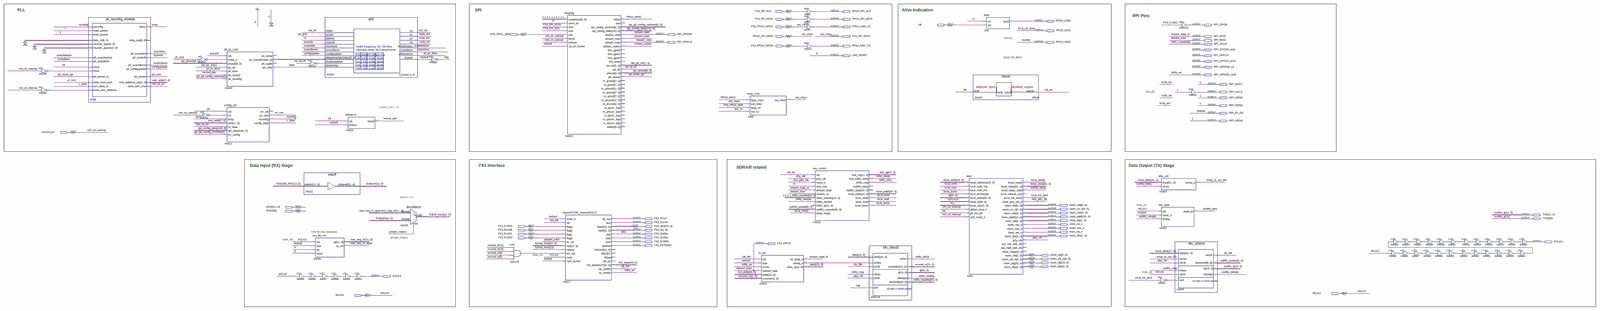
[diagram p0: schematic sheet, whole]
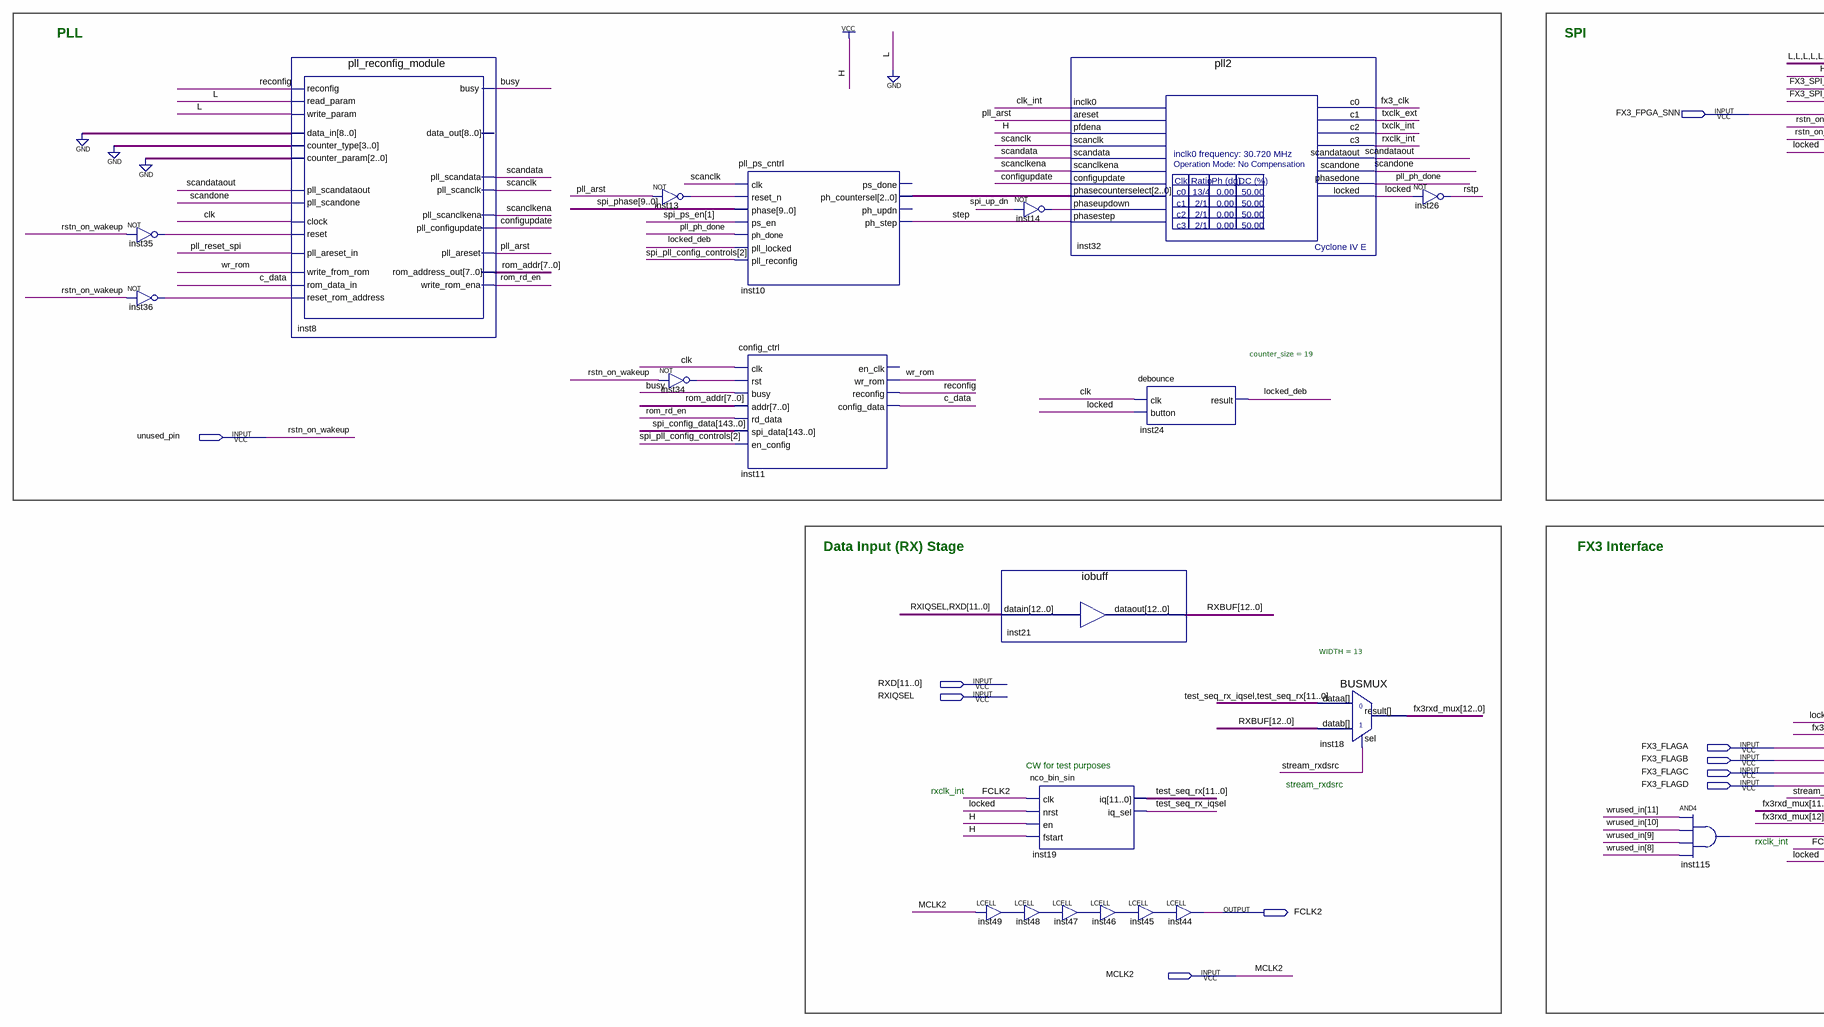
[diagram p1: schematic sheet, left part]
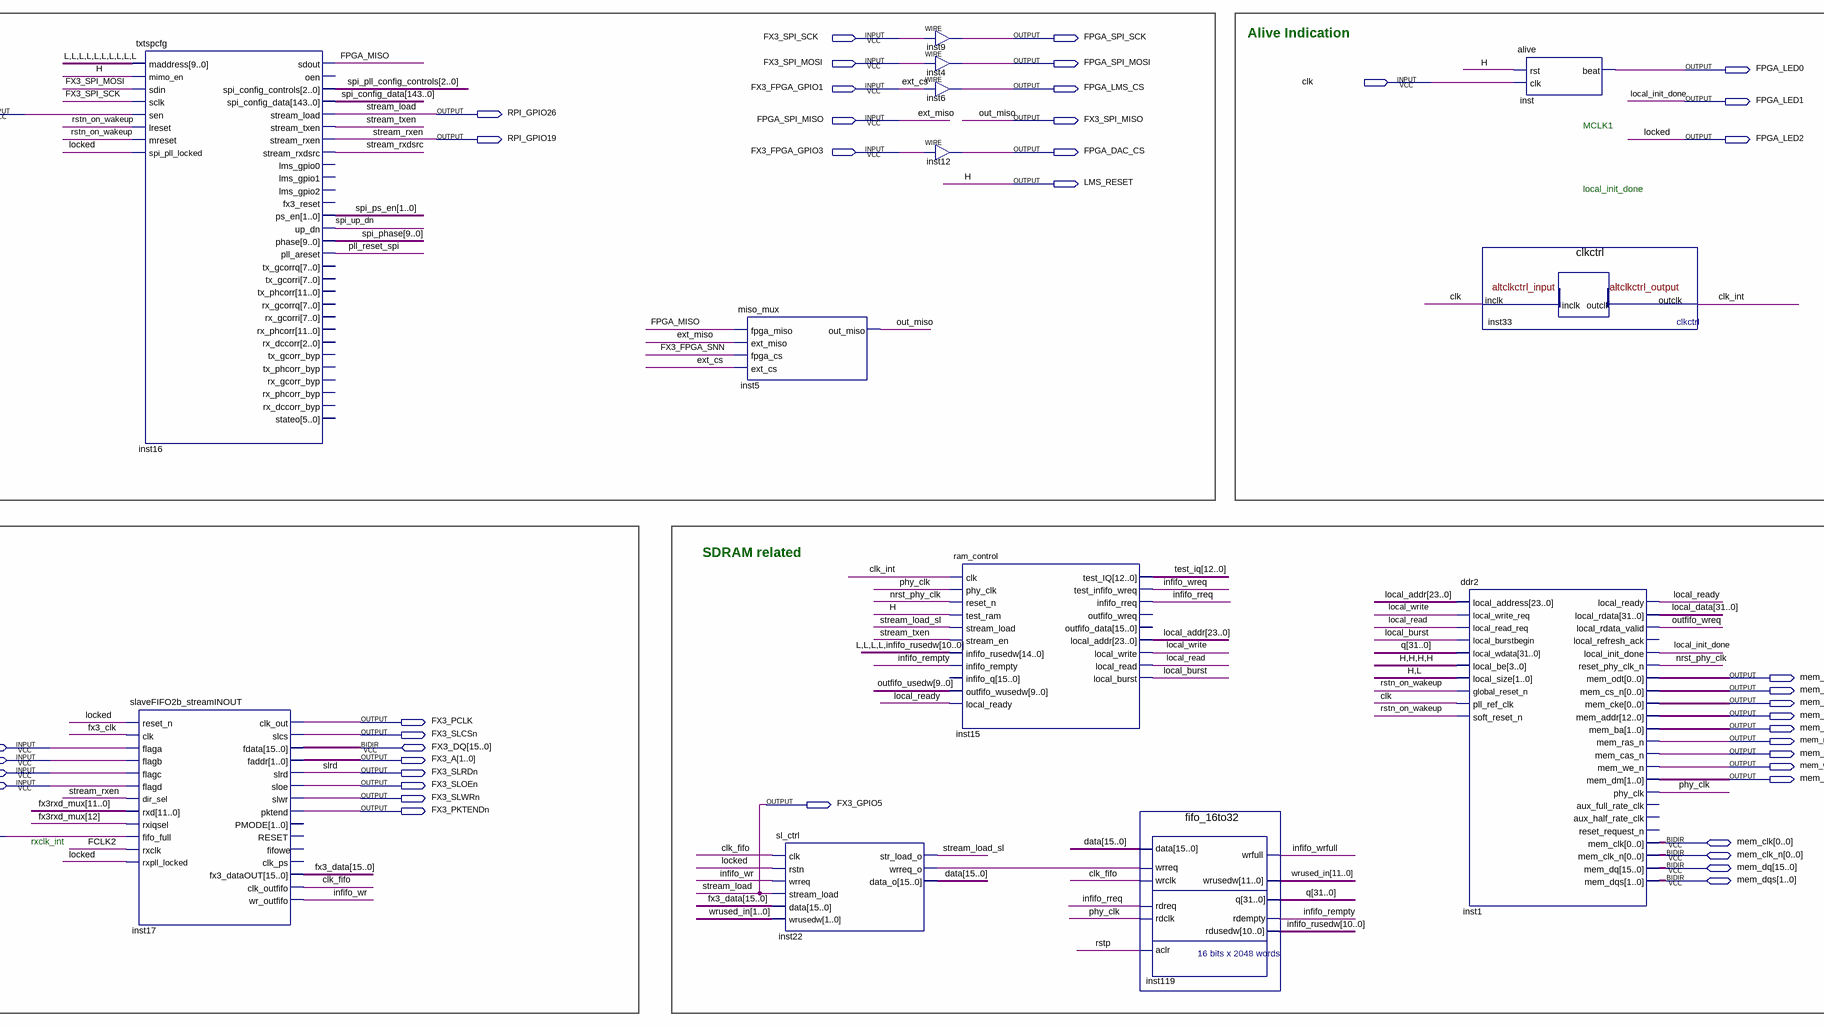
[diagram p2: schematic sheet, centre part]
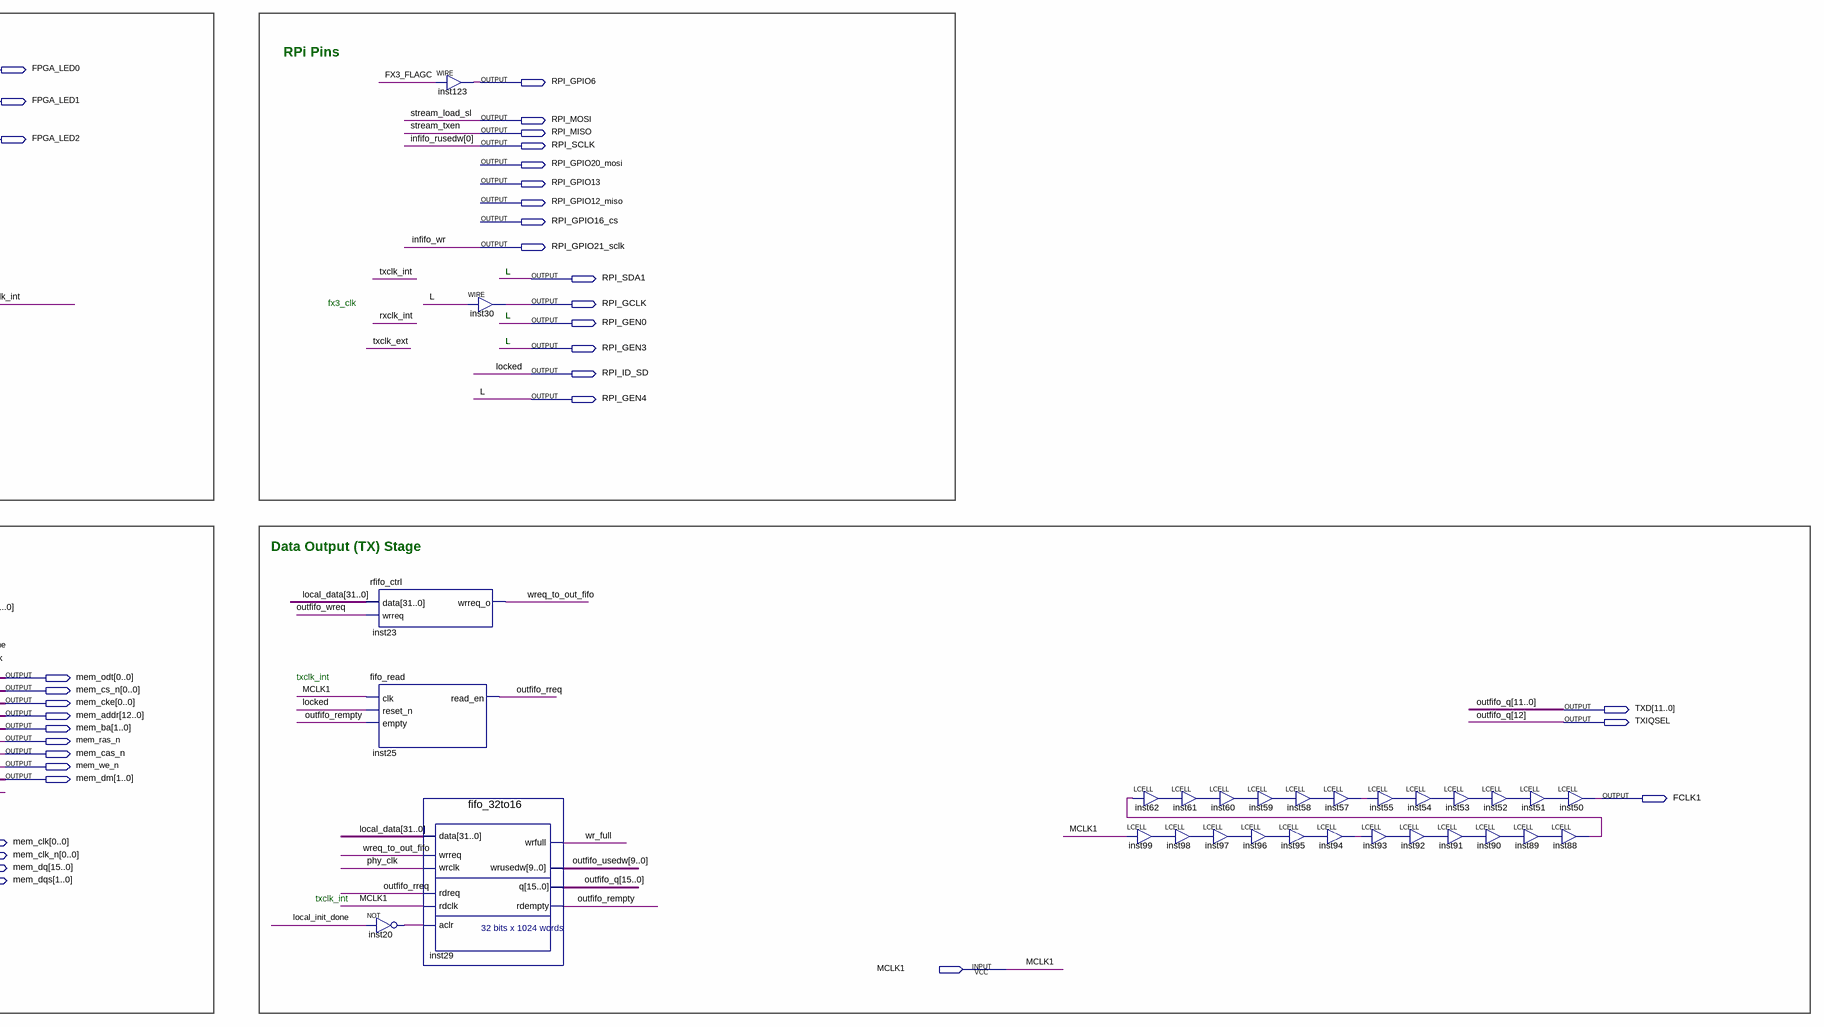
[diagram p3: schematic sheet, right part]
// Quartus schematic lms7_uStream_trx_top.bdf as structural Verilog: 64 symbols, 68 pins
module lms7_uStream_trx_top (
  input  FX3_SPI_SCK,
  input  FX3_SPI_MOSI,
  input  clk,
  input  FX3_FPGA_GPIO1,
  input  FX3_FPGA_SNN,
  input  FPGA_SPI_MISO,
  input  FX3_FPGA_GPIO3,
  input  unused_pin,
  input  [11:0] RXD,
  input  RXIQSEL,
  input  FX3_FLAGA,
  input  FX3_FLAGB,
  input  FX3_FLAGC,
  input  FX3_FLAGD,
  input  MCLK1,
  input  MCLK2,
  inout  [15:0] FX3_DQ,
  inout  [0:0] mem_clk,
  inout  [0:0] mem_clk_n,
  inout  [15:0] mem_dq,
  inout  [1:0] mem_dqs,
  output FPGA_SPI_SCK,
  output FPGA_SPI_MOSI,
  output FPGA_LED0,
  output RPI_GPIO6,
  output FPGA_LMS_CS,
  output FPGA_LED1,
  output RPI_GPIO26,
  output FX3_SPI_MISO,
  output RPI_MOSI,
  output RPI_MISO,
  output RPI_GPIO19,
  output FPGA_LED2,
  output RPI_SCLK,
  output FPGA_DAC_CS,
  output RPI_GPIO20_mosi,
  output LMS_RESET,
  output RPI_GPIO13,
  output RPI_GPIO12_miso,
  output RPI_GPIO16_cs,
  output RPI_GPIO21_sclk,
  output RPI_SDA1,
  output RPI_GCLK,
  output RPI_GEN0,
  output RPI_GEN3,
  output RPI_ID_SD,
  output RPI_GEN4,
  output [0:0] mem_odt,
  output [0:0] mem_cs_n,
  output [0:0] mem_cke,
  output [11:0] TXD,
  output [12:0] mem_addr,
  output FX3_PCLK,
  output TXIQSEL,
  output [1:0] mem_ba,
  output FX3_SLCSn,
  output mem_ras_n,
  output mem_cas_n,
  output [1:0] FX3_A,
  output mem_we_n,
  output FX3_SLRDn,
  output [1:0] mem_dm,
  output FX3_SLOEn,
  output FX3_SLWRn,
  output FCLK1,
  output FX3_GPIO5,
  output FX3_PKTENDn,
  output FCLK2
);

  wire busy, c_data, clk_fifo, clk_int, configupdate, FPGA_MISO, fx3_clk, infifo_rempty, infifo_rreq,
       infifo_wreq, infifo_wrfull, inst13_out, inst14_out, inst20_out, inst22_wrreq_o, inst34_out,
       inst35_out, inst36_out, inst45_out, inst46_out, inst47_out, inst48_out, inst49_out, inst51_out,
       inst52_out, inst53_out, inst54_out, inst55_out, inst57_out, inst58_out, inst59_out, inst60_out,
       inst61_out, inst62_out, inst88_out, inst89_out, inst90_out, inst91_out, inst92_out, inst93_out,
       inst94_out, inst95_out, inst96_out, inst97_out, inst98_out, inst99_out, inst115_out, local_burst,
       local_read, local_ready, local_write, locked_deb, nrst_phy_clk, outfifo_rempty, outfifo_rreq,
       outfifo_wreq, phy_clk, pll_arst, pll_ph_done, pll_reset_spi, reconfig, rom_rd_en, rstp, rxclk_int,
       scanclk, scanclkena, scandata, scandataout, scandone, spi_up_dn, step, stream_rxdsrc,
       test_seq_rx_iqsel, txclk_ext, txclk_int, wr_full, wr_rom, wreq_to_out_fifo;
  wire [1:0] spi_ps_en;
  wire [2:0] inst10_ph_countersel, spi_pll_config_controls;
  wire [7:0] rom_addr;
  wire [9:0] outfifo_usedw, spi_phase;
  wire [10:1] infifo_rusedw;
  wire [11:0] test_seq_rx, wrused_in;
  wire [12:0] fx3rxd_mux, RXBUF, test_iq;
  wire [15:0] data, fx3_data;
  wire [15:13] outfifo_q;
  wire [23:0] local_addr;
  wire [31:0] local_data, q;
  wire [143:0] spi_config_data;

  not inst35 (inst35_out, unused_pin);
  not inst36 (inst36_out, unused_pin);
  pll_reconfig_module inst8 (
    .reconfig(reconfig), .read_param(1'b0), .write_param(1'b0), .data_in({9{1'b0}}), .counter_type(4'b0000),
    .counter_param(3'b000), .pll_scandataout(scandataout), .pll_scandone(scandone), .clock(clk),
    .reset(inst35_out), .pll_areset_in(pll_reset_spi), .write_from_rom(wr_rom), .rom_data_in(c_data),
    .reset_rom_address(inst36_out), .busy(busy), .pll_scandata(scandata), .pll_scanclk(scanclk),
    .pll_scanclkena(scanclkena), .pll_configupdate(configupdate), .pll_areset(pll_arst),
    .rom_address_out(rom_addr), .write_rom_ena(rom_rd_en));  // open: data_out
  not inst13 (inst13_out, pll_arst);
  not inst34 (inst34_out, unused_pin);
  pll_ps_cntrl inst10 (
    .clk(scanclk), .reset_n(inst13_out), .phase(spi_phase), .ps_en(spi_ps_en[1]), .ph_done(pll_ph_done),
    .pll_locked(locked_deb), .pll_reconfig(spi_pll_config_controls[2]), .ph_countersel(inst10_ph_countersel),
    .ph_step(step));  // open: ps_done, ph_updn
  config_ctrl inst11 (
    .clk(clk), .rst(inst34_out), .busy(busy), .addr(rom_addr), .rd_data(rom_rd_en),
    .spi_data(spi_config_data), .en_config(spi_pll_config_controls[2]), .wr_rom(wr_rom), .reconfig(reconfig),
    .config_data(c_data));  // open: en_clk
  iobuff inst21 (.datain({RXIQSEL, RXD}), .dataout(RXBUF));
  LCELL inst49 (.IN(MCLK2), .OUT(inst49_out));
  not inst14 (inst14_out, spi_up_dn);
  nco_bin_sin inst19 (
    .clk(FCLK2), .nrst(FPGA_LED2), .en(1'b1), .fstart(1'b1), .iq(test_seq_rx), .iq_sel(test_seq_rx_iqsel));
  LCELL inst47 (.IN(inst48_out), .OUT(inst47_out));
  LCELL inst48 (.IN(inst49_out), .OUT(inst48_out));
  pll2 inst32 (
    .inclk0(clk_int), .areset(pll_arst), .pfdena(1'b1), .scanclk(scanclk), .scandata(scandata),
    .scanclkena(scanclkena), .configupdate(configupdate), .phasecounterselect(inst10_ph_countersel),
    .phaseupdown(inst14_out), .phasestep(step), .c0(fx3_clk), .c1(txclk_ext), .c2(txclk_int), .c3(rxclk_int),
    .scandataout(scandataout), .scandone(scandone), .phasedone(pll_ph_done), .locked(FPGA_LED2));
  LCELL inst46 (.IN(inst47_out), .OUT(inst46_out));
  debounce #(.counter_size(19)) inst24 (.clk(clk), .button(FPGA_LED2), .result(locked_deb));
  LCELL inst45 (.IN(inst46_out), .OUT(inst45_out));
  LCELL inst44 (.IN(inst45_out), .OUT(FCLK2));
  BUSMUX #(.WIDTH(13)) inst18 (
    .datab(RXBUF), .sel(stream_rxdsrc), .dataa({test_seq_rx_iqsel, test_seq_rx}), .result(fx3rxd_mux));
  not inst26 (rstp, FPGA_LED2);
  and inst115 (inst115_out, wrused_in[11], wrused_in[10], wrused_in[9], wrused_in[8]);
  txtspcfg inst16 (
    .maddress({10{1'b0}}), .mimo_en(1'b1), .sdin(FX3_SPI_MOSI), .sclk(FX3_SPI_SCK), .sen(FX3_FPGA_SNN),
    .lreset(unused_pin), .mreset(unused_pin), .spi_pll_locked(FPGA_LED2), .sdout(FPGA_MISO),
    .spi_config_controls(spi_pll_config_controls), .spi_config_data(spi_config_data),
    .stream_load(FX3_GPIO5), .stream_txen(RPI_MISO), .stream_rxen(RPI_GPIO19), .stream_rxdsrc(stream_rxdsrc),
    .ps_en(spi_ps_en), .up_dn(spi_up_dn), .phase(spi_phase), .pll_areset(pll_reset_spi));  // open: oen, lms_gpio0, lms_gpio1, lms_gpio2, fx3_reset, tx_gcorrq, tx_gcorri, tx_phcorr, rx_gcorrq, rx_gcorri, rx_phcorr, rx_dccorr, tx_gcorr_byp, tx_phcorr_byp, rx_gcorr_byp, rx_phcorr_byp, rx_dccorr_byp, stateo
  slaveFIFO2b_streamINOUT inst17 (
    .reset_n(FPGA_LED2), .clk(fx3_clk), .flaga(FX3_FLAGA), .flagb(FX3_FLAGB), .flagc(FX3_FLAGC),
    .flagd(FX3_FLAGD), .dir_sel(RPI_GPIO19), .rxd(fx3rxd_mux[11:0]), .rxiqsel(fx3rxd_mux[12]),
    .fifo_full(inst115_out), .rxclk(FCLK2), .rxpll_locked(FPGA_LED2), .clk_out(FX3_PCLK), .slcs(FX3_SLCSn),
    .faddr(FX3_A), .slrd(FX3_SLRDn), .sloe(FX3_SLOEn), .slwr(FX3_SLWRn), .pktend(FX3_PKTENDn),
    .fx3_dataOUT(fx3_data), .clk_outfifo(clk_fifo), .wr_outfifo(RPI_GPIO21_sclk), .fdata(FX3_DQ));  // open: PMODE, RESET, fifowe, clk_ps
  miso_mux inst5 (
    .fpga_miso(FPGA_MISO), .ext_miso(FPGA_SPI_MISO), .fpga_cs(FX3_FPGA_SNN), .ext_cs(FX3_FPGA_GPIO1),
    .out_miso(FX3_SPI_MISO));
  sl_ctrl inst22 (
    .clk(clk_fifo), .rstn(FPGA_LED2), .wrreq(RPI_GPIO21_sclk), .stream_load(FX3_GPIO5), .data(fx3_data),
    .wrusedw(wrused_in[1:0]), .str_load_o(RPI_MOSI), .wrreq_o(inst22_wrreq_o), .data_o(data));
  assign FPGA_SPI_SCK = FX3_SPI_SCK;  // WIRE inst9
  assign FPGA_SPI_MOSI = FX3_SPI_MOSI;  // WIRE inst4
  assign FPGA_LMS_CS = FX3_FPGA_GPIO1;  // WIRE inst6
  assign FPGA_DAC_CS = FX3_FPGA_GPIO3;  // WIRE inst12
  ram_control inst15 (
    .clk(clk_int), .phy_clk(phy_clk), .reset_n(nrst_phy_clk), .test_ram(1'b1), .stream_load(RPI_MOSI),
    .stream_en(RPI_MISO), .infifo_rusedw({4'b0000, infifo_rusedw, RPI_SCLK}), .infifo_rempty(infifo_rempty),
    .outfifo_wusedw(outfifo_usedw), .local_ready(local_ready), .test_IQ(test_iq),
    .test_infifo_wreq(infifo_wreq), .infifo_rreq(infifo_rreq), .local_addr(local_addr),
    .local_write(local_write), .local_read(local_read), .local_burst(local_burst));  // open: infifo_q, outfifo_wreq, outfifo_data
  fifo_16to32 inst119 (
    .data(data), .wrreq(inst22_wrreq_o), .wrclk(clk_fifo), .rdreq(infifo_rreq), .rdclk(phy_clk), .aclr(rstp),
    .wrfull(infifo_wrfull), .wrusedw(wrused_in), .q(q), .rdempty(infifo_rempty),
    .rdusedw({infifo_rusedw, RPI_SCLK}));
  ddr2 inst1 (
    .local_address(local_addr), .local_write_req(local_write), .local_read_req(local_read),
    .local_burstbegin(local_burst), .local_wdata(q), .local_be(4'b1111), .local_size(2'b10),
    .global_reset_n(unused_pin), .pll_ref_clk(clk), .soft_reset_n(unused_pin), .local_ready(local_ready),
    .local_rdata(local_data), .local_rdata_valid(outfifo_wreq), .local_init_done(FPGA_LED1),
    .reset_phy_clk_n(nrst_phy_clk), .mem_odt(mem_odt[0]), .mem_cs_n(mem_cs_n[0]), .mem_cke(mem_cke[0]),
    .mem_addr(mem_addr), .mem_ba(mem_ba), .mem_ras_n(mem_ras_n), .mem_cas_n(mem_cas_n), .mem_we_n(mem_we_n),
    .mem_dm(mem_dm), .phy_clk(phy_clk), .mem_clk(mem_clk[0]), .mem_clk_n(mem_clk_n[0]), .mem_dq(mem_dq),
    .mem_dqs(mem_dqs));  // open: local_refresh_ack, aux_full_rate_clk, aux_half_rate_clk, reset_request_n
  alive inst (.rst(1'b1), .clk(clk), .beat(FPGA_LED0));
  clkctrl inst33 (.inclk(clk), .outclk(clk_int));
  rfifo_ctrl inst23 (.data(local_data), .wrreq(outfifo_wreq), .wrreq_o(wreq_to_out_fifo));
  fifo_read inst25 (.clk(MCLK1), .reset_n(FPGA_LED2), .empty(outfifo_rempty), .read_en(outfifo_rreq));
  not inst20 (inst20_out, FPGA_LED1);
  assign RPI_GPIO6 = FX3_FLAGC;  // WIRE inst123
  fifo_32to16 inst29 (
    .data(local_data), .wrreq(wreq_to_out_fifo), .wrclk(phy_clk), .rdreq(outfifo_rreq), .rdclk(MCLK1),
    .aclr(inst20_out), .wrfull(wr_full), .wrusedw(outfifo_usedw), .q({outfifo_q, TXIQSEL, TXD}),
    .rdempty(outfifo_rempty));
  assign RPI_GCLK = 1'b0;  // WIRE inst30
  LCELL inst62 (.IN(inst88_out), .OUT(inst62_out));
  LCELL inst99 (.IN(MCLK1), .OUT(inst99_out));
  LCELL inst60 (.IN(inst61_out), .OUT(inst60_out));
  LCELL inst61 (.IN(inst62_out), .OUT(inst61_out));
  LCELL inst97 (.IN(inst98_out), .OUT(inst97_out));
  LCELL inst98 (.IN(inst99_out), .OUT(inst98_out));
  LCELL inst59 (.IN(inst60_out), .OUT(inst59_out));
  LCELL inst96 (.IN(inst97_out), .OUT(inst96_out));
  LCELL inst58 (.IN(inst59_out), .OUT(inst58_out));
  LCELL inst95 (.IN(inst96_out), .OUT(inst95_out));
  LCELL inst57 (.IN(inst58_out), .OUT(inst57_out));
  LCELL inst93 (.IN(inst94_out), .OUT(inst93_out));
  LCELL inst94 (.IN(inst95_out), .OUT(inst94_out));
  LCELL inst54 (.IN(inst55_out), .OUT(inst54_out));
  LCELL inst55 (.IN(inst57_out), .OUT(inst55_out));
  LCELL inst92 (.IN(inst93_out), .OUT(inst92_out));
  LCELL inst53 (.IN(inst54_out), .OUT(inst53_out));
  LCELL inst91 (.IN(inst92_out), .OUT(inst91_out));
  LCELL inst52 (.IN(inst53_out), .OUT(inst52_out));
  LCELL inst89 (.IN(inst90_out), .OUT(inst89_out));
  LCELL inst90 (.IN(inst91_out), .OUT(inst90_out));
  LCELL inst50 (.IN(inst51_out), .OUT(FCLK1));
  LCELL inst51 (.IN(inst52_out), .OUT(inst51_out));
  LCELL inst88 (.IN(inst89_out), .OUT(inst88_out));

  assign LMS_RESET = 1'b1;
  assign RPI_GEN0 = 1'b0;
  assign RPI_GEN3 = 1'b0;
  assign RPI_GEN4 = 1'b0;
  assign RPI_GPIO26 = FX3_GPIO5;
  assign RPI_ID_SD = FPGA_LED2;
  assign RPI_SDA1 = 1'b0;

  // Other names for the same wires on the sheet: ext_cs = FX3_FPGA_GPIO1; ext_miso = FPGA_SPI_MISO;
  //   infifo_rusedw[0] = RPI_SCLK; infifo_wr = RPI_GPIO21_sclk; local_init_done = FPGA_LED1; locked = FPGA_LED2;
  //   out_miso = FX3_SPI_MISO; outfifo_q[12:0] = {TXIQSEL, TXD}; rstn_on_wakeup = unused_pin; slrd = FX3_SLRDn;
  //   stream_load = FX3_GPIO5; stream_load_sl = RPI_MOSI; stream_rxen = RPI_GPIO19; stream_txen = RPI_MISO

  // Notes on the sheet:
  //   PLL
  //   SPI
  //   Alive Indication
  //   RPi Pins
  //   MCLK1
  //   local_init_done
  //   L
  //   fx3_clk
  //   L
  //   L
  //   Data Input (RX) Stage
  //   FX3 Interface
  //   Data Output (TX) Stage
  //   SDRAM related
  //   txclk_int
  //   CW for test purposes
  //   stream_rxdsrc
  //   rxclk_int
  //   rxclk_int
  //   txclk_int
endmodule
